# EasyEDA Pro project My_Project_2023-03-21.eprj

# Schematic Schematic1
Create Date: 2023-03-21; Page Name: P1; Project Name: My_Project_2023-03-21; Schematic Name: Schematic1; Update Date: 2023-05-07; Company: 嘉立创EDA; Page Size: A4; Version: V1.0
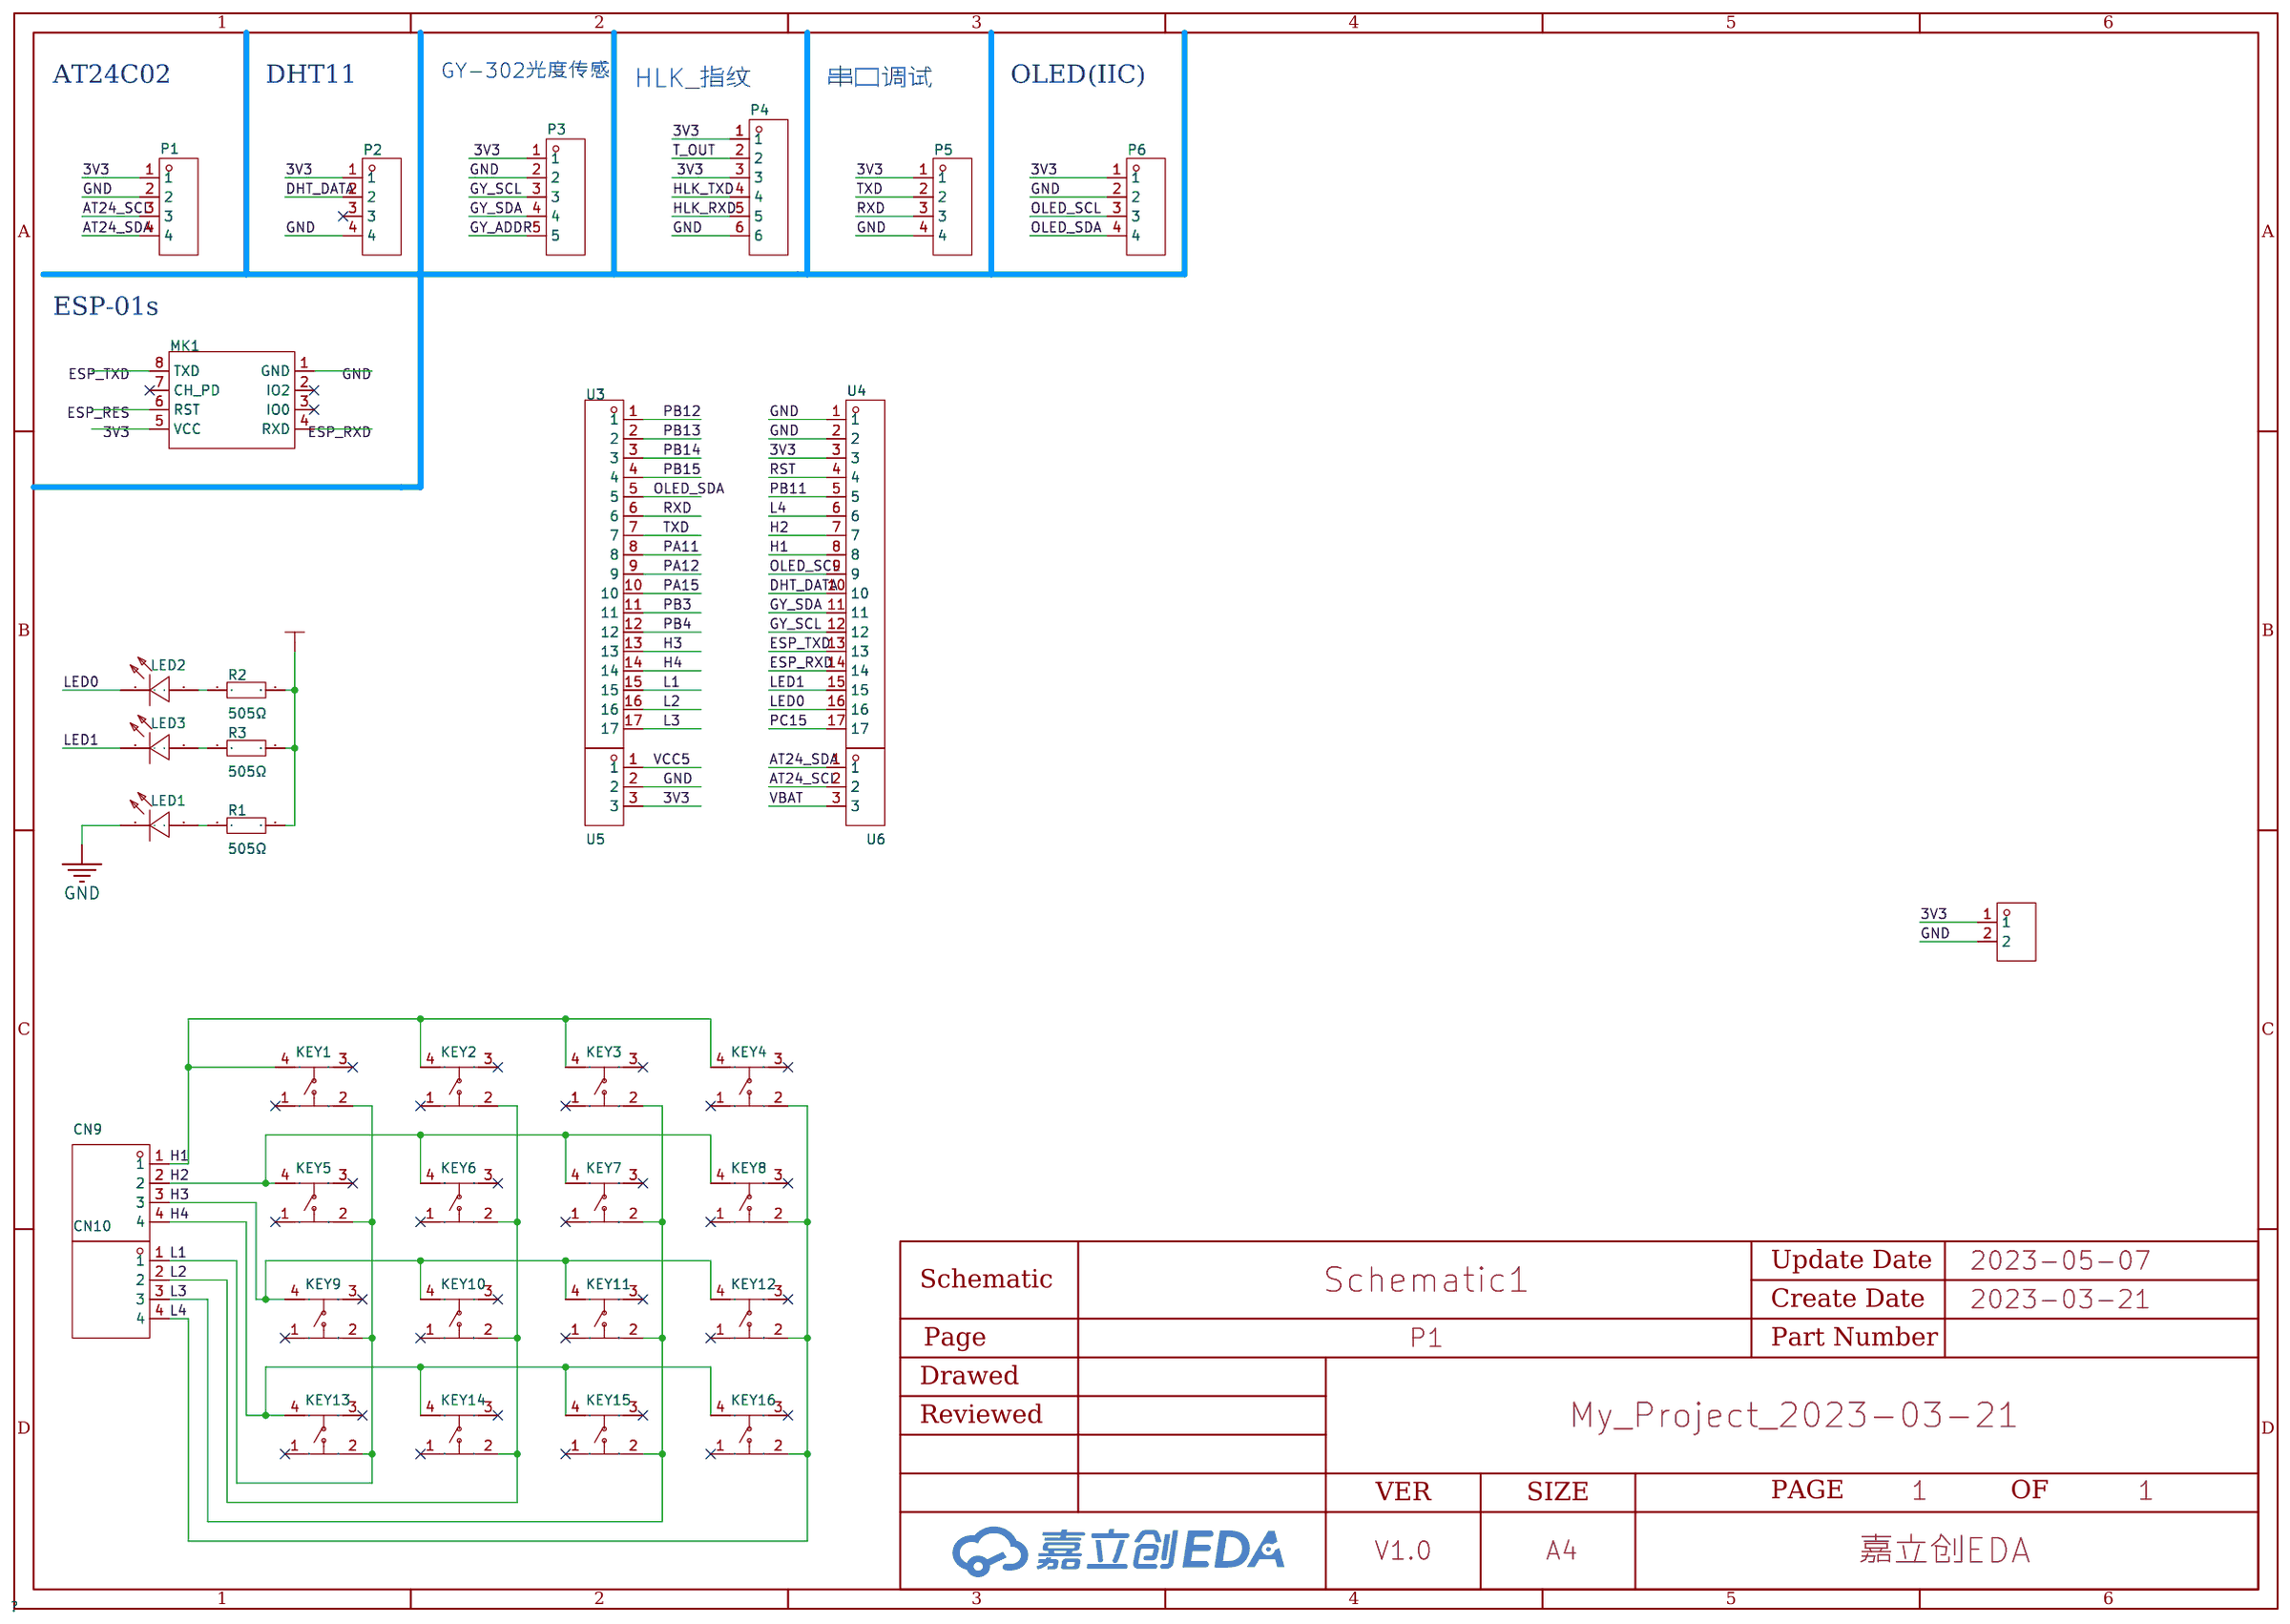
[diagram p0: schematic sheet]

## Parts
CN9  RE-H042TD-1190(LF)(SN)  [HDR-TH_4P-P2.54-V_RE-H042TD-1190]
CN10  RE-H042TD-1190(LF)(SN)  [HDR-TH_4P-P2.54-V_RE-H042TD-1190]
KEY1  TL1105AF160Q  [KEY-TH_4P-L6.0-W6.0-P4.50-LS7.5]
KEY2  TL1105AF160Q  [KEY-TH_4P-L6.0-W6.0-P4.50-LS7.5]
KEY3  TL1105AF160Q  [KEY-TH_4P-L6.0-W6.0-P4.50-LS7.5]
KEY4  TL1105AF160Q  [KEY-TH_4P-L6.0-W6.0-P4.50-LS7.5]
KEY5  TL1105AF160Q  [KEY-TH_4P-L6.0-W6.0-P4.50-LS7.5]
KEY6  TL1105AF160Q  [KEY-TH_4P-L6.0-W6.0-P4.50-LS7.5]
KEY7  TL1105AF160Q  [KEY-TH_4P-L6.0-W6.0-P4.50-LS7.5]
KEY8  TL1105AF160Q  [KEY-TH_4P-L6.0-W6.0-P4.50-LS7.5]
KEY9  TL1105AF160Q  [KEY-TH_4P-L6.0-W6.0-P4.50-LS7.5]
KEY10  TL1105AF160Q  [KEY-TH_4P-L6.0-W6.0-P4.50-LS7.5]
KEY11  TL1105AF160Q  [KEY-TH_4P-L6.0-W6.0-P4.50-LS7.5]
KEY12  TL1105AF160Q  [KEY-TH_4P-L6.0-W6.0-P4.50-LS7.5]
KEY13  TL1105AF160Q  [KEY-TH_4P-L6.0-W6.0-P4.50-LS7.5]
KEY14  TL1105AF160Q  [KEY-TH_4P-L6.0-W6.0-P4.50-LS7.5]
KEY15  TL1105AF160Q  [KEY-TH_4P-L6.0-W6.0-P4.50-LS7.5]
KEY16  TL1105AF160Q  [KEY-TH_4P-L6.0-W6.0-P4.50-LS7.5]
LED1  NCD0805R1  [LED0805-RD_RED]
LED2  NCD0805R1  [LED0805-RD_RED]
LED3  NCD0805R1  [LED0805-RD_RED]
MK1  ESP-01S  [WIRELM-TH_ESP-01S]
P1  CON4  [CONN-TH_4P-P2.50-XH2.54-4P]
P2  CON4  [CONN-TH_4P-P2.50-XH2.54-4P]
P3  XH5/2.54mm/180  [CONN-TH_5P-P2.54_C9900008095]
P4  PH6_ZZ_2MM54  [CONN-TH_6P-P2.54_PH6_ZZ_2MM54]
P5  CON4  [CONN-TH_4P-P2.50-XH2.54-4P]
P6  CON4  [CONN-TH_4P-P2.50-XH2.54-4P]
R1  505Ω  [R0805]
R2  505Ω  [R0805]
R3  505Ω  [R0805]
U3  -  [CON18]
U4  -  [CON18]
U5  XH2.54-3  [CONN-TH_3P-P2.54_XH2.54-3]
U6  XH2.54-3  [CONN-TH_3P-P2.54_XH2.54-3]
U8  DB302-5.0-2P-GN-S  [CONN-TH_DB302-5.0-2P]

## Library data of the parts
CN9 CN10 = RE-H042TD-1190(LF)(SN): 排数:单排;总PIN位数:4;间距:2.54mm;插针结构:1x4P;行距:-;安装类型:直插;圆针/方针:-;额定电流:-;额定电压:-;配合针长度:6mm;塑高:2.54mm;端接针长度:3mm;触头材质:黄铜;触头镀层:-;工作温度范围:-55℃~+125℃;颜色:黑色;; LCSC Part Name: 2.54mm 1x4P 直插; Supplier Part: C160334; Manufacturer: JST; Supplier Footprint: 直插,P=2.54mm; JLCPCB Part Class: Extended Part; Datasheet: https://atta.szlcsc.com/upload/public/pdf/source/20180420/C160334_6B88A6EA6BFB8B2BA3C08060128C528B.pdf; Supplier: LCSC; Number of Rows: 单排; Number of Pins: 4; Pitch: 2.54mm; Pin Structure: 1x4P; Mounting Type: 直插; Length of Mating Pin: 6mm; Insulation Height: 2.54mm; Length of End Connection Pin: 3mm; Contact Material: 黄铜; Operating Temperature Range: -55℃~+125℃; Color: 黑色
KEY1-KEY16 = TL1105AF160Q: 触点电流:50mA;额定电压(DC):12V;电路结构:单刀单掷;安装方式:直插;按钮形状:圆形按钮;带灯:-;开关长度:6mm;开关宽度:6mm;开关高度:1.4mm;; Supplier Part: C273465; Manufacturer: E-Switch; Supplier Footprint: 插件,6x6mm; JLCPCB Part Class: Extended Part; Datasheet: https://atta.szlcsc.com/upload/public/pdf/source/20180927/C273465_0F1BD723C3380B9DEF3A68CE1EDEA194.pdf; Supplier: LCSC; Contact Current: 50mA; Voltage Rating (DC): 12V; Circuit: 单刀单掷; Mounting Style: 直插; Actuator Style: 圆形按钮; Switch Length: 6mm; Switch Width: 6mm; Switch Height: 1.4mm
LED1-LED3 = NCD0805R1: 发光颜色:红灯;; LCSC Part Name: 红灯; Supplier Part: C84256; Manufacturer: 国星光电; Supplier Footprint: 0805; JLCPCB Part Class: Basic Part; Datasheet: https://atta.szlcsc.com/upload/public/pdf/source/20200820/C84256_F0A75A43B3EAD75808600A0514C76B99.pdf; Supplier: LCSC; Emitted Color: 红灯
MK1 = ESP-01S_C82893: PCB天线、DIP接口、方便DIY的ESP8266EX WIFI模块; Supplier Part: C82893; Supplier Footprint: WIFI模块; JLCPCB Part Class: Extended Part; Datasheet: https://atta.szlcsc.com/upload/public/pdf/source/20161024/1477288471043.pdf; Supplier: LCSC
P1 P2 P5 P6 = CON4: Supplier Part: C9900003176; Supplier Footprint: TH-4_5.8X12.5X2.54P; JLCPCB Part Class: Extended Part; Datasheet: https://atta.szlcsc.comnull; Supplier: LCSC
P3 = XH5/2.54mm/180: Supplier Part: C9900008095; Supplier Footprint: CON5; JLCPCB Part Class: Extended Part; Supplier: LCSC
P4 = PH6_ZZ_2MM54: Supplier Part: C9900012916; Supplier Footprint: CON6; JLCPCB Part Class: Extended Part; Datasheet: https://atta.szlcsc.comnull; Supplier: LCSC
R1-R3 = RN73H2ATTD5050B10: 电阻类型:金属膜电阻;阻值:505Ω;精度:±0.1%;功率:125mW;; LCSC Part Name: 金属膜电阻 505Ω ±0.1% 125mW; Supplier Part: C4038486; Manufacturer: KOA; Supplier Footprint: 0805; JLCPCB Part Class: Extended Part; Supplier: LCSC; Type: 金属膜电阻; Tolerance: ±0.1%; Power(Watts): 125mW; Temperature Coefficient: ±10ppm/℃; Operating Temperature Range: -55℃~+155℃
U3 U4 = CON18
U5 U6 = XH2.54-3: Supplier Part: C9900014997; Supplier Footprint: CON3; JLCPCB Part Class: Extended Part; Datasheet: https://atta.szlcsc.comnull; Supplier: LCSC
U8 = DB302-5.0-2P-GN-S: LCSC Part Name: 2P P=5mm; Supplier Part: C2997275; Manufacturer: DIBO(地博电气); Supplier Footprint: P=5mm; JLCPCB Part Class: Extended Part; Datasheet: https://atta.szlcsc.com/upload/public/pdf/source/20220418/F63E4822E301FF035E2D9136E480A4B5.pdf; Supplier: LCSC

## Nets
3V3: MK1.5(VCC) P1.1 P2.1 P3.1 P4.1 P4.3 P5.1 P6.1 R1.2 R2.2 R3.2 U4.3 U5.3 U8.1
GND: LED1.1(-) MK1.1(GND) P1.2 P2.4 P3.2 P4.6 P5.4 P6.2 U4.1 U4.2 U5.2 U8.2
VBAT: U6.3
VCC5: U5.1
AT24_SCL: P1.3 U6.2
AT24_SDA: P1.4 U6.1
DHT_DATA: P2.2 U4.10
ESP_RES: MK1.6(RST)
ESP_RXD: MK1.4(RXD) U4.14
ESP_TXD: MK1.8(TXD) U4.13
GY_ADDR: P3.5
GY_SCL: P3.3 U4.12
GY_SDA: P3.4 U4.11
H1: CN9.1 KEY1.4 KEY2.4 KEY3.4 KEY4.4 U4.8
H2: CN9.2 KEY5.4 KEY6.4 KEY7.4 KEY8.4 U4.7
H3: CN9.3 KEY9.4 KEY10.4 KEY11.4 KEY12.4 U3.13
H4: CN9.4 KEY13.4 KEY14.4 KEY15.4 KEY16.4 U3.14
HLK_RXD: P4.5
HLK_TXD: P4.4
L1: CN10.1 KEY1.2 KEY5.2 KEY9.2 KEY13.2 U3.15
L2: CN10.2 KEY2.2 KEY6.2 KEY10.2 KEY14.2 U3.16
L3: CN10.3 KEY3.2 KEY7.2 KEY11.2 KEY15.2 U3.17
L4: CN10.4 KEY4.2 KEY8.2 KEY12.2 KEY16.2 U4.6
LED0: LED2.1(-) U4.16
LED1: LED3.1(-) U4.15
OLED_SCL: P6.3 U4.9
OLED_SDA: P6.4 U3.5
PA11: U3.8
PA12: U3.9
PA15: U3.10
PB3: U3.11
PB4: U3.12
PB11: U4.5
PB12: U3.1
PB13: U3.2
PB14: U3.3
PB15: U3.4
PC15: U4.17
RST: U4.4
RXD: P5.3 U3.6
T_OUT: P4.2
TXD: P5.2 U3.7
$1N5538: LED3.2(+) R3.1
$1N5568: LED2.2(+) R2.1
$1N13220: LED1.2(+) R1.1

Not connected (* = marked no-connect by the designer): KEY1 1* 3*; KEY2 1* 3*; KEY3 1* 3*; KEY4 1* 3*; KEY5 1* 3*; KEY6 1* 3*; KEY7 1* 3*; KEY8 1* 3*; KEY9 1* 3*; KEY10 1* 3*; KEY11 1* 3*; KEY12 1* 3*; KEY13 1* 3*; KEY14 1* 3*; KEY15 1* 3*; KEY16 1* 3*; MK1 2(IO2)* 3(IO0)* 7(CH_PD)*; P2 3*

## Notes on the sheet
- AT24C02
- DHT11
- GY-302光度传感
- HLK_指纹
- 串口调试
- OLED(IIC)
- ESP-01s

# Board PCB1
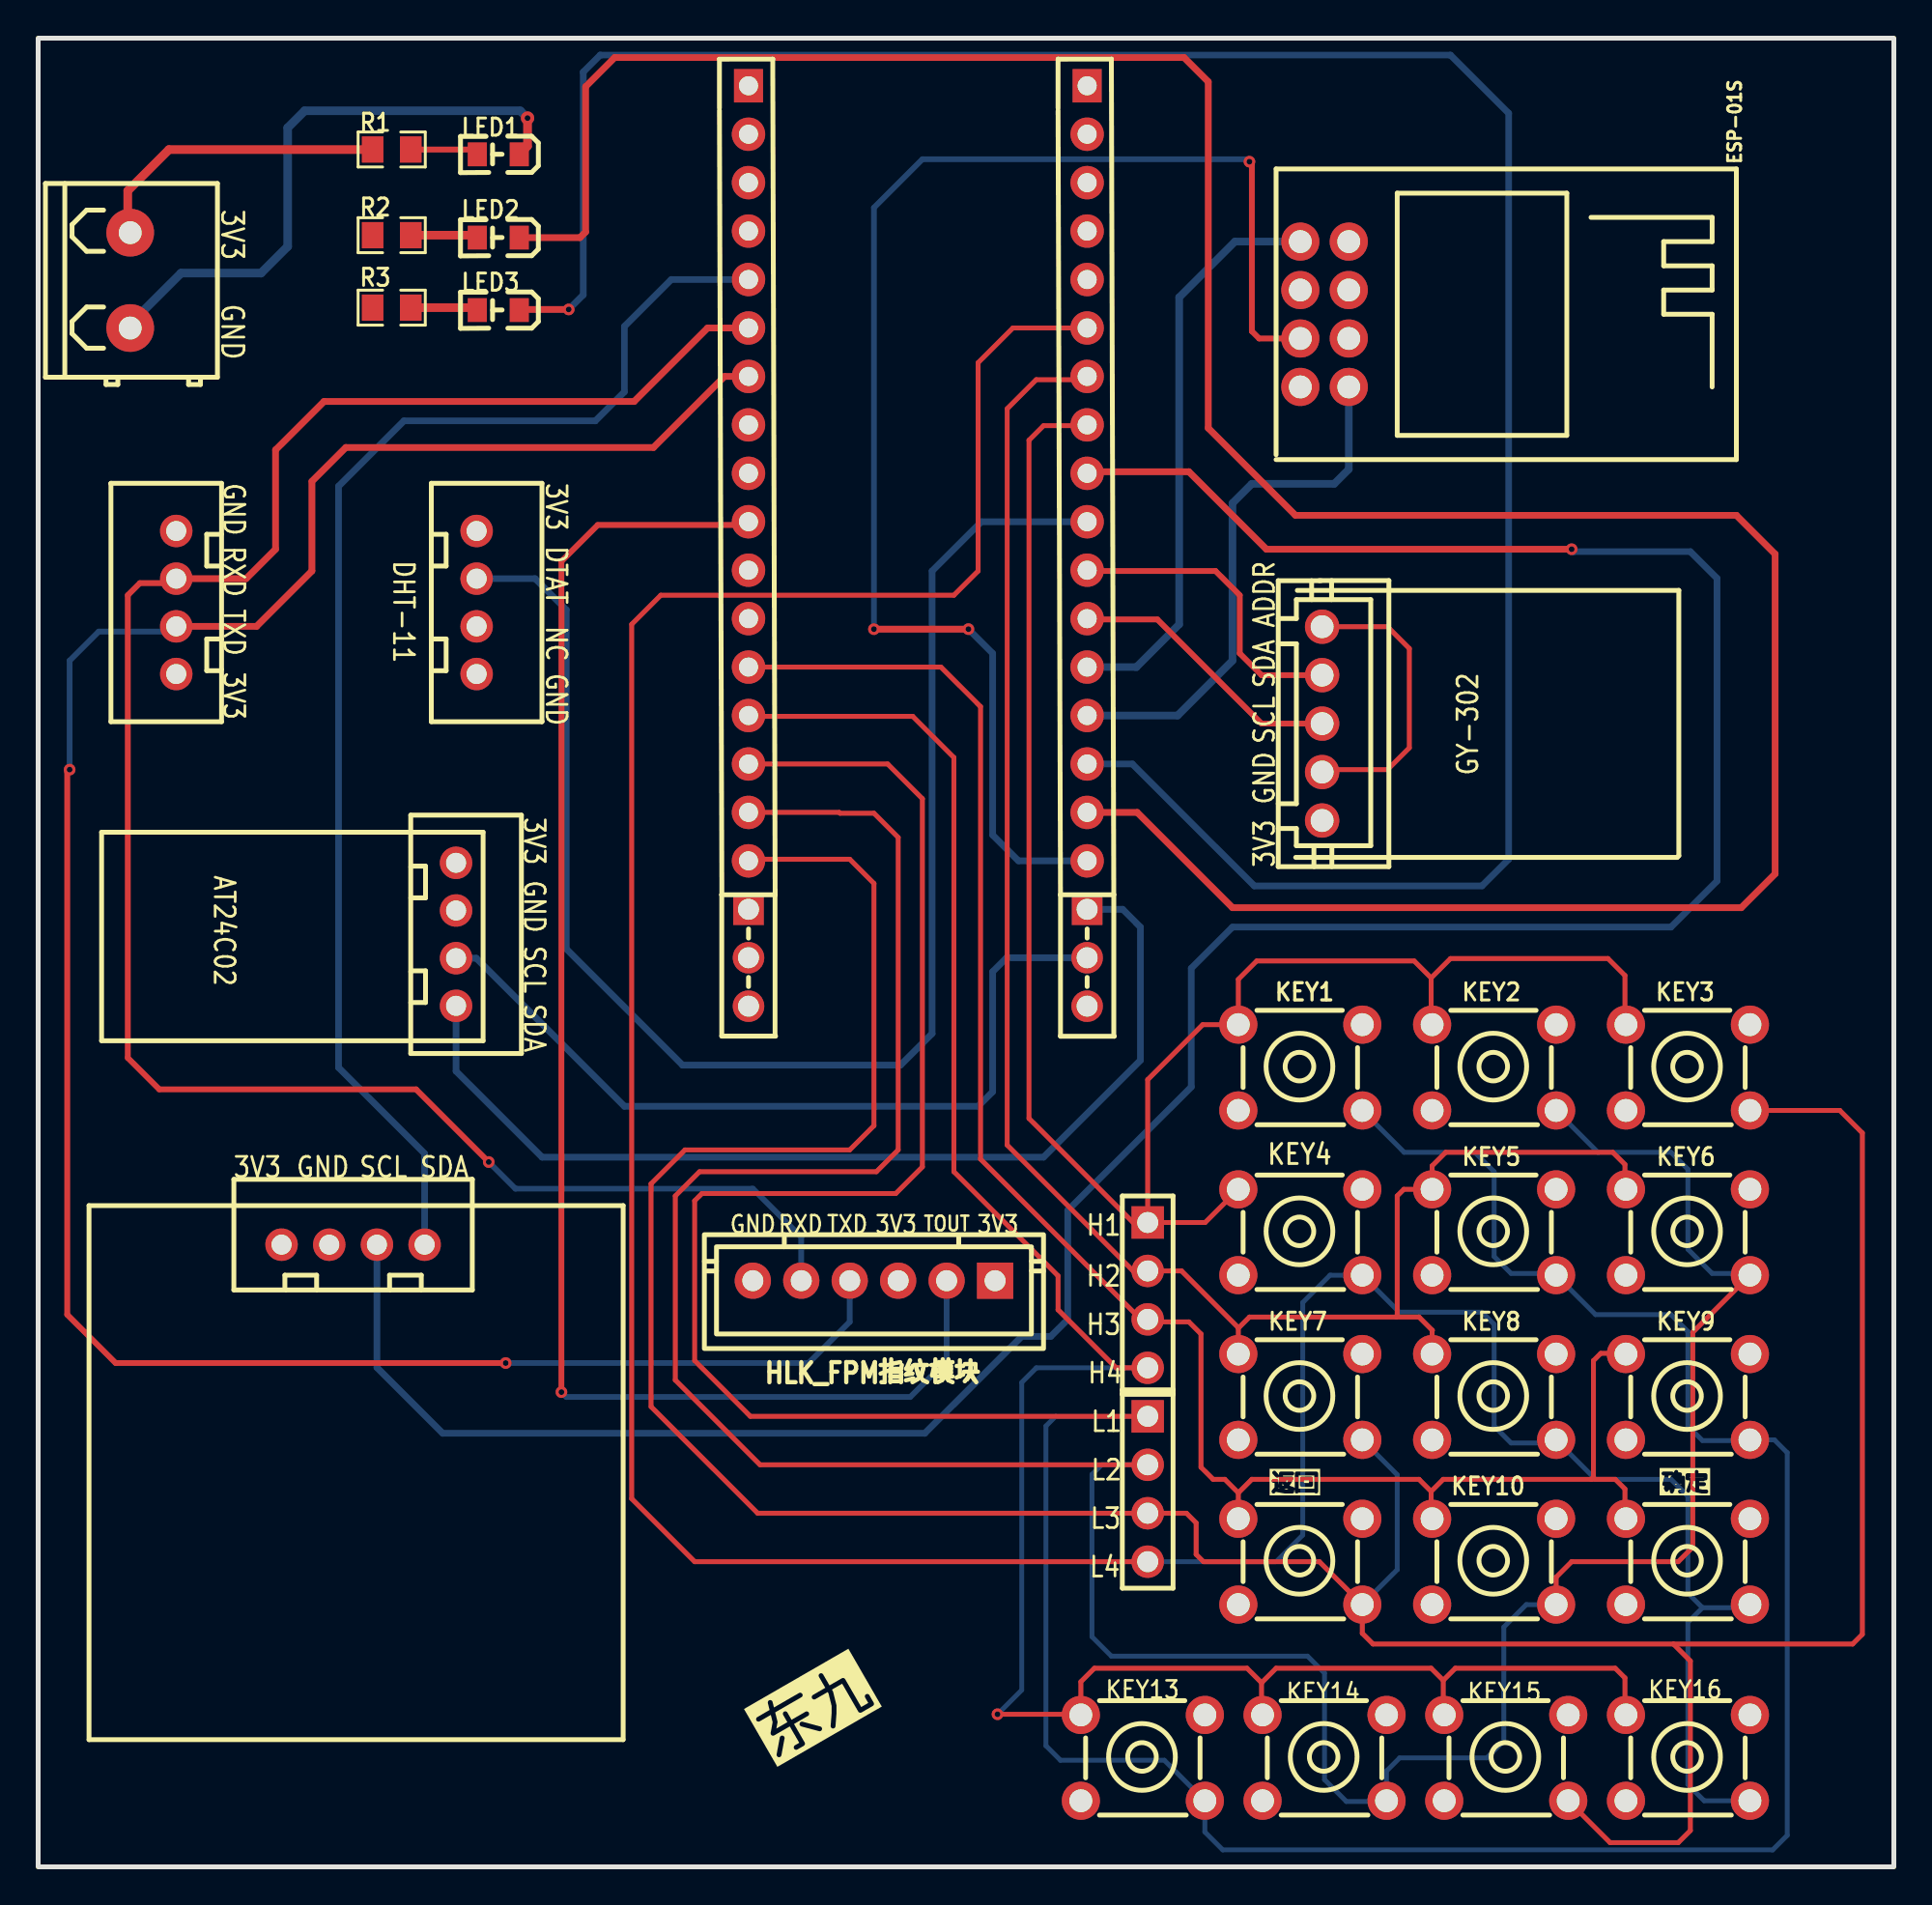
[diagram p1: board, top side]
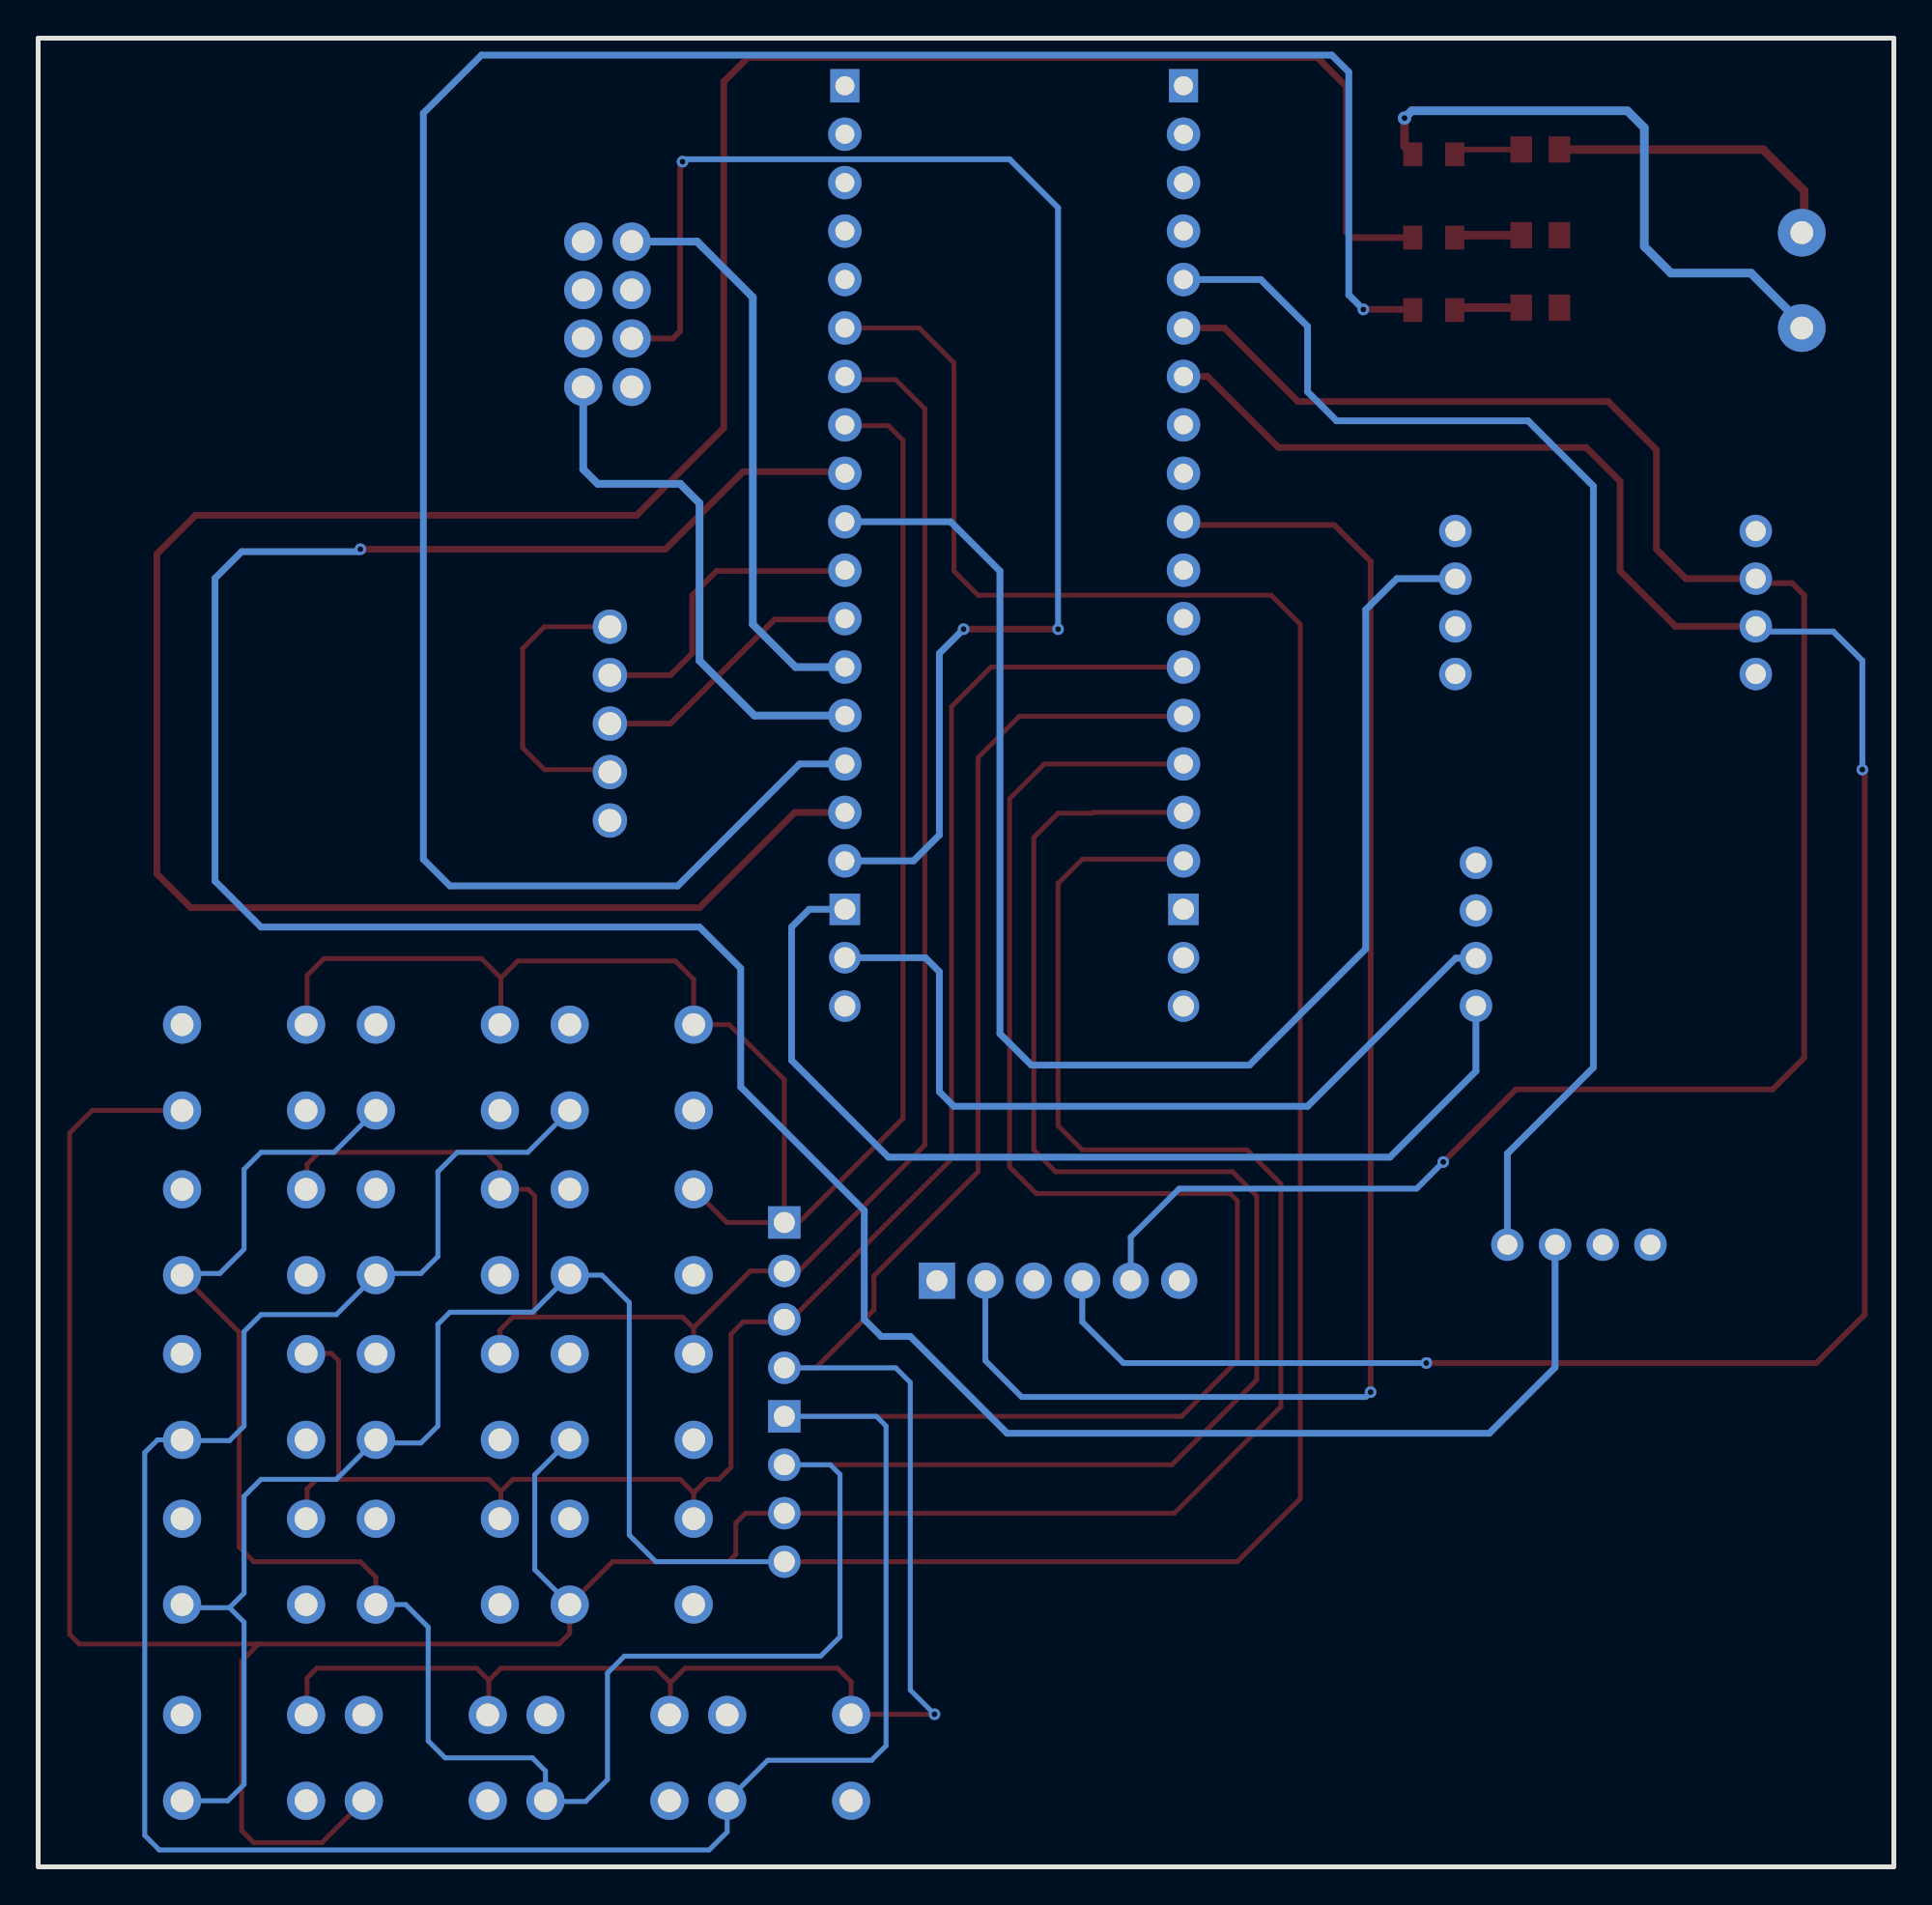
[diagram p2: board, bottom side, seen from below]

Outline 97.28 x 95.88 mm; copper layers: Top Layer, Bottom Layer. Coordinates in mm from the lower left corner of the outline.
Outline path: rectangle 0,95.88 97.28,0
Stack: Top Layer 0.035mm / Dielectric1 1.51mm FR4 er 4.5 / Bottom Layer 0.035mm

## Design rules (mm)
spacing safeClearance (default): track to track 0.152, other pairs 0.152 to 0.3
track width trackWidth (default): min 0.127, default 0.254, max 2.54
differential pair differentialPair (default): width min 0.127, default 0.254, max 2.54; gap min 0.152, default 0.152
via viaSize (default): diameter min 0.5, default 0.61, max 10; hole min 0.3, default 0.305, max 6

## Placement (name value [footprint] x y rotation side)
CN9  RE-H042TD-1190(LF)(SN)  [HDR-TH_4P-P2.54-V_RE-H042TD-1190]  58.17 29.98 270 top
CN10  RE-H042TD-1190(LF)(SN)  [HDR-TH_4P-P2.54-V_RE-H042TD-1190]  58.17 19.81 270 top
ESP-01S  ESP-01S  [WIRELM-TH_ESP-01S]  67.44 81.41 270 top
KEY1  TL1105AF160Q  [KEY-TH_4P-L6.0-W6.0-P4.50-LS7.5]  66.17 41.91 0 top
KEY2  TL1105AF160Q  [KEY-TH_4P-L6.0-W6.0-P4.50-LS7.5]  76.33 41.91 0 top
KEY3  TL1105AF160Q  [KEY-TH_4P-L6.0-W6.0-P4.50-LS7.5]  86.49 41.91 0 top
KEY4  TL1105AF160Q  [KEY-TH_4P-L6.0-W6.0-P4.50-LS7.5]  66.17 33.27 0 top
KEY5  TL1105AF160Q  [KEY-TH_4P-L6.0-W6.0-P4.50-LS7.5]  76.33 33.27 0 top
KEY6  TL1105AF160Q  [KEY-TH_4P-L6.0-W6.0-P4.50-LS7.5]  86.49 33.27 0 top
KEY7  TL1105AF160Q  [KEY-TH_4P-L6.0-W6.0-P4.50-LS7.5]  66.17 24.64 0 top
KEY8  TL1105AF160Q  [KEY-TH_4P-L6.0-W6.0-P4.50-LS7.5]  76.33 24.64 0 top
KEY9  TL1105AF160Q  [KEY-TH_4P-L6.0-W6.0-P4.50-LS7.5]  86.49 24.64 0 top
KEY10  TL1105AF160Q  [KEY-TH_4P-L6.0-W6.0-P4.50-LS7.5]  76.33 16 0 top
KEY13  TL1105AF160Q  [KEY-TH_4P-L6.0-W6.0-P4.50-LS7.5]  57.91 5.72 0 top
KEY14  TL1105AF160Q  [KEY-TH_4P-L6.0-W6.0-P4.50-LS7.5]  67.44 5.72 0 top
KEY15  TL1105AF160Q  [KEY-TH_4P-L6.0-W6.0-P4.50-LS7.5]  76.96 5.72 0 top
KEY16  TL1105AF160Q  [KEY-TH_4P-L6.0-W6.0-P4.50-LS7.5]  86.49 5.72 0 top
LED1  NCD0805R1  [LED0805-RD_RED]  24.12 89.79 180 top
LED2  NCD0805R1  [LED0805-RD_RED]  24.12 85.43 180 top
LED3  NCD0805R1  [LED0805-RD_RED]  24.12 81.63 180 top
P1  CON4  [CONN-TH_4P-P2.50-XH2.54-4P]  21.91 48.89 90 top
P2  CON4  [CONN-TH_4P-P2.50-XH2.54-4P]  22.99 66.29 90 top
P3  XH5/2.54mm/180  [CONN-TH_5P-P2.54_C9900008095]  67.31 59.94 90 top
P4  PH6_ZZ_2MM54  [CONN-TH_6P-P2.54_PH6_ZZ_2MM54]  43.81 30.73 180 top
P5  CON4  [CONN-TH_4P-P2.50-XH2.54-4P]  7.24 66.29 270 top
P6  CON4  [CONN-TH_4P-P2.50-XH2.54-4P]  16.51 32.62 180 top
R1  505Ω  [R0805]  18.53 90.05 180 top
R2  505Ω  [R0805]  18.53 85.55 180 top
R3  505Ω  [R0805]  18.53 81.75 180 top
U3  -  [CON18]  38.38 41.95 270 top
U4  -  [CON18]  56.13 41.95 270 top
U5  XH2.54-3  [CONN-TH_3P-P2.54_XH2.54-3]  37.24 47.67 270 top
U6  XH2.54-3  [CONN-TH_3P-P2.54_XH2.54-3]  54.99 47.67 270 top
U8  DB302-5.0-2P-GN-S  [CONN-TH_DB302-5.0-2P]  4.83 83.18 270 top
确定  TL1105AF160Q  [KEY-TH_4P-L6.0-W6.0-P4.50-LS7.5]  86.49 16 0 top
返回  TL1105AF160Q  [KEY-TH_4P-L6.0-W6.0-P4.50-LS7.5]  66.17 16 0 top

## Footprints (pads in the part's own frame, mm; a bottom-side part is the same pattern mirrored in y, then rotated)
CON18
  rect 1.75x1.524 hole 1: 1(-51.435,-1.143)
  round 1.75 hole 1: 2(-48.895,-1.143) 3(-46.355,-1.143) 4(-43.815,-1.143) 5(-41.275,-1.143) 6(-38.735,-1.143) 7(-36.195,-1.143) 8(-33.655,-1.143) 9(-31.115,-1.143) 10(-28.575,-1.143) 11(-26.035,-1.143) 12(-23.495,-1.143) 13(-20.955,-1.143) 14(-18.415,-1.143) 15(-15.875,-1.143) 16(-13.335,-1.143) 17(-10.795,-1.143)
CONN-TH_3P-P2.54_XH2.54-3
  rect 1.65x1.6 hole 1.1: 1(-2.54,0)
  round 1.65 hole 1.1: 2(0,0) 3(2.54,0)
CONN-TH_4P-P2.50-XH2.54-4P
  round 1.7 hole 1.05: 1(3.75,0) 2(1.25,0) 3(-1.25,0) 4(-3.75,0)
CONN-TH_5P-P2.54_C9900008095
  round 1.8 hole 1.2: 1(-5.08,0) 2(-2.54,0) 3(0,0) 4(2.541,0) 5(5.08,0)
CONN-TH_6P-P2.54_PH6_ZZ_2MM54
  rect 1.9x1.9 hole 1.1: 1(-6.35,0)
  round 1.9 hole 1.1: 2(-3.81,0) 3(-1.27,0) 4(1.27,0) 5(3.81,0) 6(6.35,0)
CONN-TH_DB302-5.0-2P
  round 2.5 hole 1.2: 1(-2.5,0) 2(2.5,0)
HDR-TH_4P-P2.54-V_RE-H042TD-1190
  rect 1.7x1.7 hole 1.1: 1(-3.81,0)
  round 1.7 hole 1.1: 2(-1.27,0) 3(1.27,0) 4(3.81,0)
KEY-TH_4P-L6.0-W6.0-P4.50-LS7.5
  round 2 hole 1.2: 1(-3.25,-2.25) 2(3.25,-2.25) 3(3.25,2.25) 4(-3.25,2.25)
LED0805-RD_RED
  rect 1x1.25 smd: 1(-1.1,0) 2(1.1,0)
R0805
  rect 1.133x1.377 smd: 1(-1,0) 2(1,0)
WIRELM-TH_ESP-01S
  round 2 hole 1.2: 1(-3.81,1.27) 2(-1.27,1.27) 3(1.27,1.27) 4(3.81,1.27) 5(3.81,-1.27) 6(1.27,-1.27) 7(-1.27,-1.27) 8(-3.81,-1.27)

## Nets
3V3: ESP-01S.5 P1.1 P2.1 P3.1 P4.1 P4.3 P5.1 P6.1 R1.2 R2.2 R3.2 U4.3 U5.3 U8.1
GND: ESP-01S.1 LED1.1 P1.2 P2.4 P3.2 P3.5 P4.6 P5.4 P6.2 U4.1 U4.2 U5.2 U8.2
VBAT: U6.3
VCC5: U5.1
AT24_SCL: P1.3 U6.2
AT24_SDA: P1.4 U6.1
DHT_DATA: P2.2 U4.10
ESP_RES: ESP-01S.6 U4.17
ESP_RXD: ESP-01S.4 U4.14
ESP_TXD: ESP-01S.8 U4.13
GY_SCL: P3.3 U4.12
GY_SDA: P3.4 U4.11
H1: CN9.1 KEY1.4 KEY2.4 KEY3.4 KEY4.4 U4.8
H2: CN9.2 KEY5.4 KEY6.4 KEY7.4 KEY8.4 U4.7
H3: CN9.3 KEY9.4 KEY10.4 U3.13 确定.4 返回.4
H4: CN9.4 KEY13.4 KEY14.4 KEY15.4 KEY16.4 U3.14
L1: CN10.1 KEY1.2 KEY5.2 KEY9.2 KEY13.2 U3.15
L2: CN10.2 KEY2.2 KEY6.2 KEY10.2 KEY14.2 U3.16
L3: CN10.3 KEY3.2 KEY7.2 KEY15.2 U3.17 返回.2
L4: CN10.4 KEY4.2 KEY8.2 KEY16.2 U4.6 确定.2
LED0: LED2.1 U4.16
LED1: LED3.1 U4.15
OLED_SCL: P6.3 U4.9
OLED_SDA: P6.4 U3.5
PA11: U3.8
PA12: U3.9
PA15: P4.2 U3.10
PB3: U3.11
PB4: U3.12
PB11: U4.5
PB12: U3.1
PB13: U3.2
PB14: U3.3
PB15: U3.4
RST: U4.4
RXD: P4.5 P5.3 U3.6
TXD: P4.4 P5.2 U3.7
$1N5538: LED3.2 R3.1
$1N5568: LED2.2 R2.1
$1N13220: LED1.2 R1.1

Pads without a net: ESP-01S 2 3 7; KEY1 1 3; KEY2 1 3; KEY3 1 3; KEY4 1 3; KEY5 1 3; KEY6 1 3; KEY7 1 3; KEY8 1 3; KEY9 1 3; KEY10 1 3; KEY13 1 3; KEY14 1 3; KEY15 1 3; KEY16 1 3; P2 3; 确定 1 3; 返回 1 3

## Via types
v1: diameter 0.61, hole 0.305, Top Layer to Bottom Layer, 10 vias
v2: diameter 0.7, hole 0.305, Top Layer to Bottom Layer, 1 via

## Routing (per net, layer and track width the routed paths; a pad name or vN(x,y) marks a point on that pad's centre or on a via; arc(x,y) is an arc through that point)
3V3: length 16
  Top Layer w0.45: U8.1 4.7,85.81 4.7,87.88 6.86,90.04 17.53,90.04 R1.2
GND: length 46.9
  Top Layer w0.254: P3.5 70.74,65.02 71.88,63.88 71.88,58.67 70.74,57.53 67.44,57.53 P3.2
  Top Layer w0.45: LED1.1 25.65,90.23 v2(25.65,91.69)
  Bottom Layer w0.45: U8.2 4.83,80.9 7.49,83.57 11.68,83.57 13.08,84.96 13.08,91.19 13.97,92.07 25.27,92.07 v2(25.65,91.69)
AT24_SCL: length 43.2
  Bottom Layer w0.35: P1.3 22.97,47.64 30.73,39.88 49.28,39.88 50.04,40.64 50.04,46.94 50.77,47.67 U6.2
AT24_SDA: length 53.4
  Bottom Layer w0.35: U6.1 56.85,50.21 57.78,49.28 57.78,42.29 52.7,37.21 26.42,37.21 21.91,41.72 P1.4
DHT_DATA: length 79
  Bottom Layer w0.35: U4.10 49.45,70.53 46.86,67.94 46.86,43.69 45.21,42.04 33.78,42.04 27.69,48.13 27.69,65.91 26.06,67.54 P2.2
ESP_RES: length 76.1
  Top Layer w0.3: v1(63.5,89.41) 63.63,89.28 63.63,80.52 64.01,80.14 ESP-01S.6
  Top Layer w0.35: v1(48.77,64.9) v1(43.81,64.9)
  Bottom Layer w0.3: v1(43.81,64.9) 43.81,86.99 46.35,89.53 63.37,89.53
  Bottom Layer w0.35: U4.17 51.39,52.75 50.04,54.1 50.04,63.63 v1(48.77,64.9)
ESP_RXD: length 28.2
  Bottom Layer w0.4: 68.71,77.6 68.71,73.28 67.94,72.52 63.63,72.52 62.61,71.5 62.61,63.25 59.73,60.37 U4.14
ESP_TXD: length 30.5
  Bottom Layer w0.4: U4.13 57.57,62.91 59.82,65.15 59.82,82.3 62.74,85.22 ESP-01S.8
GY_SCL: length 14.6
  Top Layer w0.3: U4.12 55.03,65.4 58.67,65.4 64.13,59.94 P3.3
GY_SDA: length 16.4
  Top Layer w0.3: P3.4 64.13,62.48 62.99,63.63 62.99,66.67 61.72,67.94 55.03,67.94 U4.11
H1: length 95.6
  Top Layer w0.254: KEY2.4 73.03,44.21 73.03,46.61 ; 73.03,46.61 74.04,47.62 82.3,47.62 83.19,46.74 83.19,44.21 KEY3.4 ; 73.03,46.61 72.14,47.5 63.88,47.5 62.92,46.53 KEY1.4 61.05,44.16 58.17,41.27 CN9.1 ; U4.8 54.95,75.56 52.7,75.56 51.94,74.8 51.94,39.24 57.4,33.79 CN9.1 ; CN9.1 61.18,33.79 KEY4.4
H2: length 94.5
  Top Layer w0.254: 71.19,28.83 71.25,28.88 71.25,35.18 71.59,35.52 KEY5.4 73.08,36.75 73.79,37.46 82.55,37.46 83.19,36.83 83.19,35.58 KEY6.4 ; 71.19,28.83 72.39,28.83 73.09,28.13 73.08,28.12 KEY8.4 ; 71.19,28.83 63.5,28.83 62.92,28.25 ; U4.7 54.82,77.98 52.32,77.98 50.8,76.45 50.8,37.85 57.4,31.25 CN9.2 59.94,31.25 62.92,28.27 62.92,28.25 ; 62.92,28.25 KEY7.4
H3: length 95.4
  Top Layer w0.254: 62.92,19.61 63.63,20.32 72.39,20.32 73.03,19.69 ; 62.92,19.61 返回.4 ; 62.92,19.61 62.21,20.32 61.59,20.32 60.96,20.95 60.96,27.94 60.32,28.57 58.3,28.57 CN9.3 57.81,28.71 49.4,37.11 49.4,60.83 47.33,62.91 U3.13 ; 81.42,20.32 73.66,20.32 73.03,19.69 ; 81.42,20.32 81.53,20.44 81.53,26.54 81.91,26.92 83.2,26.92 KEY9.4 ; 81.42,20.32 82.68,20.32 83.19,19.81 83.19,18.3 确定.4 ; 73.03,19.69 73.03,18.3 KEY10.4
H4: length 115.5
  Top Layer w0.254: v1(50.29,8) 54.63,8 KEY13.4 54.66,9.7 55.37,10.41 63.37,10.41 64.13,9.65 ; 73.66,9.78 73.03,10.41 64.9,10.41 64.13,9.65 ; 73.66,9.78 73.66,8.02 KEY15.4 ; 73.66,9.78 74.29,10.41 82.68,10.41 83.19,9.91 83.19,8.02 KEY16.4 ; 64.13,9.65 64.13,8.02 KEY14.4 ; U3.14 37.28,60.32 45.85,60.32 48.01,58.17 48.01,36.45 53.47,30.99 53.47,29.21 56.51,26.17 CN9.4
  Bottom Layer w0.254: v1(50.29,8) 51.56,9.27 51.56,25.4 52.33,26.17 CN9.4
L1: length 195.2
  Top Layer w0.254: U3.15 44.53,57.83 46.35,56.01 46.35,36.7 44.96,35.31 34.8,35.31 34.42,34.92 34.42,26.54 37.34,23.62 CN10.1
  Bottom Layer w0.254: KEY1.2 71.61,37.46 75.31,37.46 76.33,36.45 76.33,32 77.22,31.11 79.49,31.11 KEY5.2 81.64,28.96 85.6,28.96 86.49,28.07 86.49,23.11 87.25,22.35 89.7,22.35 KEY9.2 91.02,22.39 91.69,21.72 91.69,1.65 90.93,0.89 62.1,0.89 61.16,1.83 KEY13.2 59.04,5.59 53.59,5.59 52.83,6.35 52.83,23.11 53.34,23.62 CN10.1
L2: length 166.2
  Top Layer w0.254: KEY10.2 79.58,15.19 80.39,16 85.98,16 86.74,16.76 86.74,28.03 KEY6.2 ; U3.16 41.99,55.29 42.04,55.24 43.81,55.24 45.08,53.97 45.08,37.59 43.94,36.45 34.67,36.45 33.4,35.18 33.4,25.53 37.85,21.08 CN10.2
  Bottom Layer w0.254: KEY6.2 89.65,31.11 87.76,31.11 86.49,32.38 86.49,36.58 85.6,37.46 81.77,37.46 KEY2.2 ; KEY10.2 78.01,13.75 76.83,12.57 76.83,6.6 75.95,5.72 71.37,5.72 70.69,5.03 KEY14.2 70.65,3.43 68.58,3.43 67.44,4.57 67.44,10.16 66.55,11.05 56.26,11.05 55.25,12.06 55.25,20.57 55.75,21.08 CN10.2
L3: length 175.7
  Top Layer w0.254: KEY15.2 82.41,1.27 85.98,1.27 86.61,1.91 86.61,10.79 85.72,11.68 ; U3.17 37.32,52.83 42.54,52.83 43.81,51.56 43.81,38.86 42.54,37.59 33.91,37.59 32.13,35.81 32.13,24.13 37.72,18.54 CN10.3 60.2,18.54 60.71,18.03 60.71,16.38 61.09,16 67.17,16 返回.2 69.42,12.24 69.98,11.68 85.72,11.68 ; 85.72,11.68 95.12,11.68 95.63,12.19 95.63,38.48 94.45,39.66 KEY3.2
  Bottom Layer w0.254: 返回.2 71.25,15.58 71.25,20.56 KEY7.2
L4: length 182.6
  Top Layer w0.254: CN10.4 34.42,16 31.11,19.3 31.11,65.15 32.64,66.67 48.01,66.67 49.28,67.94 49.28,78.87 51.1,80.69 U4.6
  Bottom Layer w0.254: 87.25,13.59 86.49,14.35 86.49,19.43 85.6,20.32 81.64,20.32 KEY8.2 79.41,22.22 77.22,22.22 76.33,23.11 76.33,28.45 75.69,29.08 71.36,29.08 KEY4.2 67.73,31.02 66.29,29.59 66.29,17.4 64.9,16 CN10.4 ; 87.25,13.59 86.49,12.83 86.49,4.32 87.34,3.47 KEY16.2 ; 87.25,13.59 89.57,13.59 确定.2
LED0: length 151.3
  Top Layer w0.35: U4.16 57.61,55.29 62.61,50.29 89.28,50.29 91.06,52.07 91.06,68.83 89.03,70.87 65.91,70.87 61.34,75.44 61.34,93.6 60.07,94.87 30.23,94.87 28.7,93.34 28.7,85.72 28.4,85.43 LED2.1
LED1: length 130
  Top Layer w0.35: LED3.1 25.25,81.66 v1(27.81,81.66)
  Bottom Layer w0.35: v1(27.81,81.66) 28.57,82.42 28.57,94.11 29.46,95 74.04,95 77.09,91.95 77.09,52.83 75.69,51.43 63.75,51.43 57.36,57.83 U4.15
OLED_SCL: length 148.4
  Top Layer w0.35: v1(80.39,69.09) 64.39,69.09 60.32,73.15 55.08,73.15 U4.9
  Bottom Layer w0.35: P6.3 17.76,26.18 21.21,22.73 46.48,22.73 51.56,27.81 53.09,27.81 53.97,28.7 53.97,34.42 60.45,40.89 60.45,47.12 62.61,49.28 85.6,49.28 88.01,51.69 88.01,67.56 86.61,68.96 80.52,68.96 v1(80.39,69.09)
OLED_SDA: length 69.6
  Bottom Layer w0.35: U3.5 33.19,83.23 30.73,80.77 30.73,77.34 29.21,75.82 19.18,75.82 15.75,72.39 15.75,41.91 20.26,37.4 P6.4
PA15: length 79.5
  Top Layer w0.3: U3.10 37.07,70.36 29.34,70.36 27.43,68.45 v1(27.43,24.89)
  Bottom Layer w0.3: v1(27.43,24.89) 27.69,24.64 45.72,24.64 47.62,26.54 P4.2
RXD: length 107.1
  Top Layer w0.3: v1(23.62,36.96) 19.81,40.77 6.35,40.77 4.7,42.42 4.7,66.67 5.33,67.31 7,67.31 P5.3
  Top Layer w0.35: U3.6 35.09,80.69 31.24,76.83 14.99,76.83 12.45,74.29 12.45,69.09 10.9,67.54 P5.3
  Bottom Layer w0.3: P4.5 40,33.02 37.47,35.56 25.02,35.56 v1(23.62,36.96)
TXD: length 124.2
  Top Layer w0.3: v1(24.51,26.42) 4.06,26.42 1.52,28.96 1.52,57.4 v1(1.65,57.53)
  Top Layer w0.35: P5.2 11.45,65.04 14.35,67.94 14.35,72.64 16.13,74.42 32.26,74.42 35.98,78.15 U3.7
  Bottom Layer w0.3: P4.4 42.54,28.57 40.39,26.42 v1(24.51,26.42) 24.38,26.54 ; v1(1.65,57.53) 1.65,63.25 3.17,64.77 6.96,64.77 P5.2
$1N5538: length 3.5
  Top Layer w0.45: R3.1 22.89,81.75 LED3.2
$1N5568: length 3.5
  Top Layer w0.45: R2.1 22.89,85.55 LED2.2
$1N13220: length 3.6
  Top Layer w0.3: R1.1 22.77,90.05 LED1.2

## Copper pours and planes (outline as drawn; the poured copper is in the pictures)
3V3 on Top Layer: 0,90.55 5.46,90.55 5.46,95.88 90.93,95.88 90.93,90.55 91.06,90.42 97.16,90.42 97.28,90.55 97.28,5.59 97.41,5.46 92.2,5.46 92.2,0 5.71,0 5.59,4.95 5.33,5.21 0,5.21
GND on Bottom Layer: 0,90.55 5.46,90.55 5.46,95.88 90.93,95.88 90.93,90.55 91.06,90.42 97.16,90.42 97.28,90.55 97.28,5.59 97.41,5.46 92.2,5.46 92.2,0 5.71,0 5.59,4.95 5.33,5.21 0,5.21

## Text on the board
Top Silkscreen Layer: TOUT | GND | RXD | TXD | 3V3 | SCL | SDA | H1 | H2 | H3 | H4 | L4 | L3 | L1 | L2 | ADDR | GY-302 | AT24C02 | DHT-11 | DTAT | NC | KEY4 | HLK_FPM指纹模块 | 东九
